# EAGLE design M-N-SRAM-V3 (EAGLE 9.4.2)
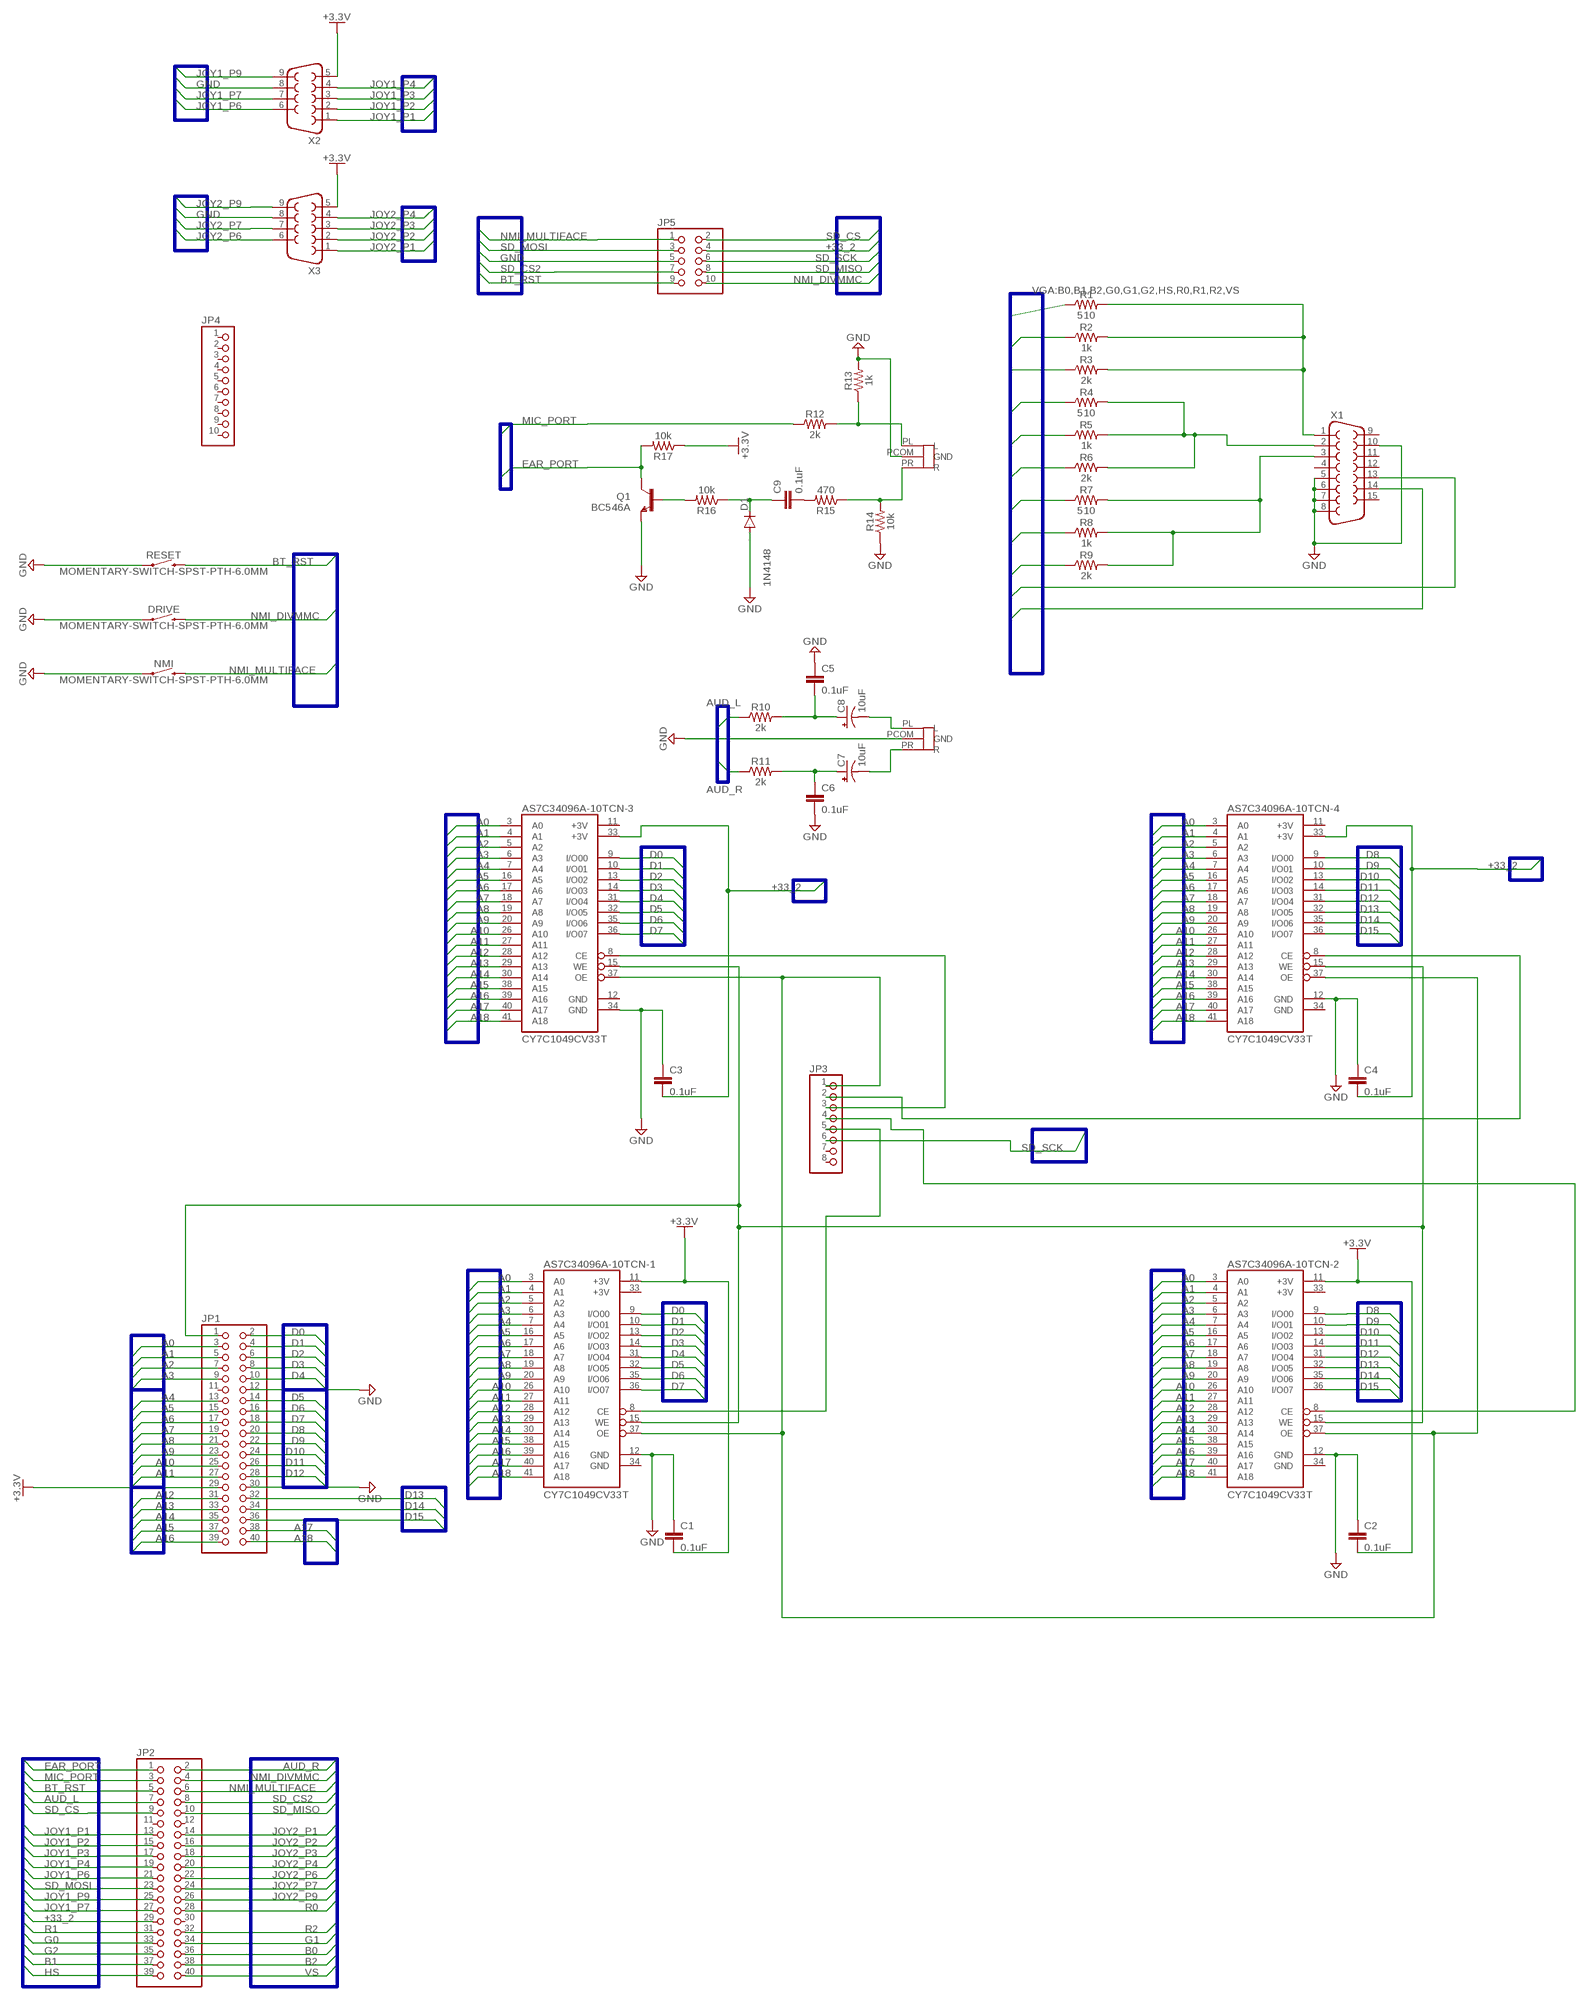
[diagram p0: schematic, sheet 1]

## Parts
AS7C34096A-10TCN-1  CY7C1049CV33T  [TSOPII-Z44]
AS7C34096A-10TCN-2  CY7C1049CV33T  [TSOPII-Z44]
AS7C34096A-10TCN-3  CY7C1049CV33T  [TSOPII-Z44]
AS7C34096A-10TCN-4  CY7C1049CV33T  [TSOPII-Z44]
AUDIOOUT  AUDIOJACK  [AUDIOJACK]
C1  0.1uF  0.1UF-KIT-EZ-50V-20%  [CAP-PTH-SMALL-KIT]
C2  0.1uF  0.1UF-KIT-EZ-50V-20%  [CAP-PTH-SMALL-KIT]
C3  0.1uF  0.1UF-KIT-EZ-50V-20%  [CAP-PTH-SMALL-KIT]
C4  0.1uF  0.1UF-KIT-EZ-50V-20%  [CAP-PTH-SMALL-KIT]
C5  0.1uF  0.1UF-KIT-EZ-50V-20%  [CAP-PTH-SMALL-KIT]
C6  0.1uF  0.1UF-KIT-EZ-50V-20%  [CAP-PTH-SMALL-KIT]
C7  10uF  10UF-POLAR-RADIAL-2.5MM-25V-20%  [CPOL-RADIAL-2.5MM-5MM]
C8  10uF  10UF-POLAR-RADIAL-2.5MM-25V-20%  [CPOL-RADIAL-2.5MM-5MM]
C9  0.1uF  0.1UF-KIT-EZ-50V-20%  [CAP-PTH-SMALL-KIT]
D1  1N4148  1N4148DO35-7  [DO35-7]
DRIVE  MOMENTARY-SWITCH-SPST-PTH-6.0MM  [TACTILE_SWITCH_PTH_6.0MM]
EAR/MIC  AUDIOJACK  [AUDIOJACK]
JP1  PINHD-2X20  [2X20]
JP2  PINHD-2X20  [2X20]
JP3  PINHD-1X8  [1X08]
JP4  PINHD-1X10  [1X10]
JP5  PINHD-2X5  [2X05]
NMI  MOMENTARY-SWITCH-SPST-PTH-6.0MM  [TACTILE_SWITCH_PTH_6.0MM]
Q1  BC546A  [TO92-EBC]
R1  510  1KOHM-HORIZ-1/4W-1%  [AXIAL-0.3]
R2  1k  1KOHM-HORIZ-1/4W-1%  [AXIAL-0.3]
R3  2k  1KOHM-HORIZ-1/4W-1%  [AXIAL-0.3]
R4  510  1KOHM-HORIZ-1/4W-1%  [AXIAL-0.3]
R5  1k  1KOHM-HORIZ-1/4W-1%  [AXIAL-0.3]
R6  2k  1KOHM-HORIZ-1/4W-1%  [AXIAL-0.3]
R7  510  1KOHM-HORIZ-1/4W-1%  [AXIAL-0.3]
R8  1k  1KOHM-HORIZ-1/4W-1%  [AXIAL-0.3]
R9  2k  1KOHM-HORIZ-1/4W-1%  [AXIAL-0.3]
R10  2k  1KOHM-HORIZ-1/4W-1%  [AXIAL-0.3]
R11  2k  1KOHM-HORIZ-1/4W-1%  [AXIAL-0.3]
R12  2k  1KOHM-HORIZ-1/4W-1%  [AXIAL-0.3]
R13  1k  1KOHM-HORIZ-1/4W-1%  [AXIAL-0.3]
R14  10k  1KOHM-HORIZ-1/4W-1%  [AXIAL-0.3]
R15  470  1KOHM-HORIZ-1/4W-1%  [AXIAL-0.3]
R16  10k  1KOHM-HORIZ-1/4W-1%  [AXIAL-0.3]
R17  10k  1KOHM-HORIZ-1/4W-1%  [AXIAL-0.3]
RESET  MOMENTARY-SWITCH-SPST-PTH-6.0MM  [TACTILE_SWITCH_PTH_6.0MM]
X1  F15HDH  [HDF15H]
X2  F09H  [F09H]
X3  F09H  [F09H]

## Nets
+3.3V: AS7C34096A-10TCN-1.11(+3V) AS7C34096A-10TCN-2.11(+3V) C1.2 C2.2 R17.P$1 X2.5 X3.5
+3V: JP1.29 ; supply symbol labelled +3.3V
+33_2: AS7C34096A-10TCN-3.33(+3V) AS7C34096A-10TCN-4.33(+3V) C3.2 C4.2 JP2.29 JP5.4
A0: AS7C34096A-10TCN-1.3(A0) AS7C34096A-10TCN-2.3(A0) AS7C34096A-10TCN-3.3(A0) AS7C34096A-10TCN-4.3(A0) JP1.3
A1: AS7C34096A-10TCN-1.4(A1) AS7C34096A-10TCN-2.4(A1) AS7C34096A-10TCN-3.4(A1) AS7C34096A-10TCN-4.4(A1) JP1.5
A2: AS7C34096A-10TCN-1.5(A2) AS7C34096A-10TCN-2.5(A2) AS7C34096A-10TCN-3.5(A2) AS7C34096A-10TCN-4.5(A2) JP1.7
A3: AS7C34096A-10TCN-1.6(A3) AS7C34096A-10TCN-2.6(A3) AS7C34096A-10TCN-3.6(A3) AS7C34096A-10TCN-4.6(A3) JP1.9
A4: AS7C34096A-10TCN-1.7(A4) AS7C34096A-10TCN-2.7(A4) AS7C34096A-10TCN-3.7(A4) AS7C34096A-10TCN-4.7(A4) JP1.13
A5: AS7C34096A-10TCN-1.16(A5) AS7C34096A-10TCN-2.16(A5) AS7C34096A-10TCN-3.16(A5) AS7C34096A-10TCN-4.16(A5) JP1.15
A6: AS7C34096A-10TCN-1.17(A6) AS7C34096A-10TCN-2.17(A6) AS7C34096A-10TCN-3.17(A6) AS7C34096A-10TCN-4.17(A6) JP1.17
A7: AS7C34096A-10TCN-1.18(A7) AS7C34096A-10TCN-2.18(A7) AS7C34096A-10TCN-3.18(A7) AS7C34096A-10TCN-4.18(A7) JP1.19
A8: AS7C34096A-10TCN-1.19(A8) AS7C34096A-10TCN-2.19(A8) AS7C34096A-10TCN-3.19(A8) AS7C34096A-10TCN-4.19(A8) JP1.21
A9: AS7C34096A-10TCN-1.20(A9) AS7C34096A-10TCN-2.20(A9) AS7C34096A-10TCN-3.20(A9) AS7C34096A-10TCN-4.20(A9) JP1.23
A10: AS7C34096A-10TCN-1.26(A10) AS7C34096A-10TCN-2.26(A10) AS7C34096A-10TCN-3.26(A10) AS7C34096A-10TCN-4.26(A10) JP1.25
A11: AS7C34096A-10TCN-1.27(A11) AS7C34096A-10TCN-2.27(A11) AS7C34096A-10TCN-3.27(A11) AS7C34096A-10TCN-4.27(A11) JP1.27
A12: AS7C34096A-10TCN-1.28(A12) AS7C34096A-10TCN-2.28(A12) AS7C34096A-10TCN-3.28(A12) AS7C34096A-10TCN-4.28(A12) JP1.31
A13: AS7C34096A-10TCN-1.29(A13) AS7C34096A-10TCN-2.29(A13) AS7C34096A-10TCN-3.29(A13) AS7C34096A-10TCN-4.29(A13) JP1.33
A14: AS7C34096A-10TCN-1.30(A14) AS7C34096A-10TCN-2.30(A14) AS7C34096A-10TCN-3.30(A14) AS7C34096A-10TCN-4.30(A14) JP1.35
A15: AS7C34096A-10TCN-1.38(A15) AS7C34096A-10TCN-2.38(A15) AS7C34096A-10TCN-3.38(A15) AS7C34096A-10TCN-4.38(A15) JP1.37
A16: AS7C34096A-10TCN-1.39(A16) AS7C34096A-10TCN-2.39(A16) AS7C34096A-10TCN-3.39(A16) AS7C34096A-10TCN-4.39(A16) JP1.39
A17: AS7C34096A-10TCN-1.40(A17) AS7C34096A-10TCN-2.40(A17) AS7C34096A-10TCN-3.40(A17) AS7C34096A-10TCN-4.40(A17) JP1.38
A18: AS7C34096A-10TCN-1.41(A18) AS7C34096A-10TCN-2.41(A18) AS7C34096A-10TCN-3.41(A18) AS7C34096A-10TCN-4.41(A18) JP1.40
AUD_L: JP2.7 R10.P$1
AUD_R: JP2.2 R11.P$1
AUDIO_OUT_L: AUDIOOUT.PL(L) C8.2(-)
AUDIO_OUT_L1: C5.2 C8.1(+) R10.P$2
AUDIO_OUT_R: AUDIOOUT.PR(R) C7.2(-)
AUDIO_OUT_R1: C6.1 C7.1(+) R11.P$2
B0: JP2.36 R7.P$1
B1: JP2.37 R8.P$1
B2: JP2.38 R9.P$1
BT_RST: JP2.5 JP5.9 RESET.3
D0: AS7C34096A-10TCN-1.9(I/O00) AS7C34096A-10TCN-3.9(I/O00) JP1.2
D1: AS7C34096A-10TCN-1.10(I/O01) AS7C34096A-10TCN-3.10(I/O01) JP1.4
D2: AS7C34096A-10TCN-1.13(I/O02) AS7C34096A-10TCN-3.13(I/O02) JP1.6
D3: AS7C34096A-10TCN-1.14(I/O03) AS7C34096A-10TCN-3.14(I/O03) JP1.8
D4: AS7C34096A-10TCN-1.31(I/O04) AS7C34096A-10TCN-3.31(I/O04) JP1.10
D5: AS7C34096A-10TCN-1.32(I/O05) AS7C34096A-10TCN-3.32(I/O05) JP1.14
D6: AS7C34096A-10TCN-1.35(I/O06) AS7C34096A-10TCN-3.35(I/O06) JP1.16
D7: AS7C34096A-10TCN-1.36(I/O07) AS7C34096A-10TCN-3.36(I/O07) JP1.18
D8: AS7C34096A-10TCN-2.9(I/O00) AS7C34096A-10TCN-4.9(I/O00) JP1.20
D9: AS7C34096A-10TCN-2.10(I/O01) AS7C34096A-10TCN-4.10(I/O01) JP1.22
D10: AS7C34096A-10TCN-2.13(I/O02) AS7C34096A-10TCN-4.13(I/O02) JP1.24
D11: AS7C34096A-10TCN-2.14(I/O03) AS7C34096A-10TCN-4.14(I/O03) JP1.26
D12: AS7C34096A-10TCN-2.31(I/O04) AS7C34096A-10TCN-4.31(I/O04) JP1.28
D13: AS7C34096A-10TCN-2.32(I/O05) AS7C34096A-10TCN-4.32(I/O05) JP1.32
D14: AS7C34096A-10TCN-2.35(I/O06) AS7C34096A-10TCN-4.35(I/O06) JP1.34
D15: AS7C34096A-10TCN-2.36(I/O07) AS7C34096A-10TCN-4.36(I/O07) JP1.36
EAR_PORT: JP2.1 Q1.C R17.P$2
G0: JP2.33 R4.P$1
G1: JP2.34 R5.P$1
G2: JP2.35 R6.P$1
GND: AS7C34096A-10TCN-1.12(GND) AS7C34096A-10TCN-2.12(GND) AS7C34096A-10TCN-3.34(GND) AS7C34096A-10TCN-4.12(GND) AUDIOOUT.PCOM(GND) C1.1 C2.1 C3.1 C4.1 C5.1 C6.2 D1.A DRIVE.1 EAR/MIC.PCOM(GND) JP1.12 JP1.30 JP5.5 NMI.1 Q1.E R13.P$2 R14.P$1 RESET.1 X1.5 X1.6 X1.7 X1.8 X1.10 X2.8 X3.8
HS: JP2.39 X1.13
JOY1_P1: JP2.13 X2.1
JOY1_P2: JP2.15 X2.2
JOY1_P3: JP2.17 X2.3
JOY1_P4: JP2.19 X2.4
JOY1_P6: JP2.21 X2.6
JOY1_P7: JP2.27 X2.7
JOY1_P9: JP2.25 X2.9
JOY2_P1: JP2.14 X3.1
JOY2_P2: JP2.16 X3.2
JOY2_P3: JP2.18 X3.3
JOY2_P4: JP2.20 X3.4
JOY2_P6: JP2.22 X3.6
JOY2_P7: JP2.24 X3.7
JOY2_P9: JP2.26 X3.9
MIC_PORT: JP2.3 R12.P$1
N$5: EAR/MIC.PL(L) R12.P$2 R13.P$1
N$7: C9.2 R15.P$2
N$8: EAR/MIC.PR(R) R14.P$2 R15.P$1
N$9: C9.1 D1.C R16.P$1
N$10: Q1.B R16.P$2
NMI_DIVMMC: DRIVE.3 JP2.4 JP5.10
NMI_MULTIFACE: JP2.6 JP5.1 NMI.3
R0: JP2.28 R1.P$1
R1: JP2.31 R2.P$1
R2: JP2.32 R3.P$1
RAM_CE1: AS7C34096A-10TCN-1.8(CE) JP3.5
RAM_CE2: AS7C34096A-10TCN-2.8(CE) JP3.4
RAM_CE3: AS7C34096A-10TCN-3.8(CE) JP3.3
RAM_CE4: AS7C34096A-10TCN-4.8(CE) JP3.2
RAM_OE: AS7C34096A-10TCN-1.37(OE) AS7C34096A-10TCN-2.37(OE) AS7C34096A-10TCN-3.37(OE) AS7C34096A-10TCN-4.37(OE) JP3.1
RAM_WE: AS7C34096A-10TCN-1.15(WE) AS7C34096A-10TCN-2.15(WE) AS7C34096A-10TCN-3.15(WE) AS7C34096A-10TCN-4.15(WE) JP1.1
SD_CS: JP2.9 JP5.2
SD_CS2: JP2.8 JP5.7
SD_MISO: JP2.10 JP5.8
SD_MOSI: JP2.23 JP5.3
SD_SCK: JP3.6 JP5.6
VGA_BLUE: R7.P$2 R8.P$2 R9.P$2 X1.3
VGA_GREEN: R4.P$2 R5.P$2 R6.P$2 X1.2
VGA_RED: R1.P$2 R2.P$2 R3.P$2 X1.1
VS: JP2.40 X1.14
Unconnected: JP1.11 JP2.11 JP2.12 JP2.30 JP3.7 JP3.8 JP4.1 JP4.2 JP4.3 JP4.4 JP4.5 JP4.6 JP4.7 JP4.8 JP4.9 JP4.10 X1.4 X1.9 X1.11 X1.12 X1.15

## Buses
ADDRESS:A0,A1,A2,A3,A4,A5,A6,A7,A8,A9,A10,A11,A12,A13,A14,A15,A16,A17,A18
DATA:D0,D1,D2,D3,D4,D5,D6,D7,D8,D9,D10,D11,D12,D13,D14,D15
VGA:B0,B1,B2,G0,G1,G2,HS,R0,R1,R2,VS
AUDIO:AUD_L,AUD_R
EARMIC:EAR_PORT,MIC_PORT
JP2_ODD:+33_2,AUD_L,B1,BT_RST,EAR_PORT,G0,G2,HS,JOY1_P1,JOY1_P2,JOY1_P3,JOY1_P4,JOY1_P6,JOY1_P7,JOY1_P9,MIC_PORT,R1,SD_CS,SD_MOSI
JP2_EVEN:AUD_R,B0,B2,G1,GND,JOY2_P1,JOY2_P2,JOY2_P3,JOY2_P4,JOY2_P6,JOY2_P7,JOY2_P9,NMI_DIVMMC,NMI_MULTIFACE,R0,R2,SD_CS2,SD_MISO,VS
BUTTONS:BT_RST,NMI_DIVMMC,NMI_MULTIFACE
JOY1_2:JOY1_P1,JOY1_P2,JOY1_P3,JOY1_P4
JOY1_1:GND,JOY1_P6,JOY1_P7,JOY1_P9
JOY2_1:GND,JOY2_P6,JOY2_P7,JOY2_P9
JOY2_2:JOY2_P1,JOY2_P2,JOY2_P3,JOY2_P4
SRAM_3_VCC:+33_2
SRAM4_VCC:+33_2
JP13_1:BT_RST,GND,NMI_MULTIFACE,SD_CS2,SD_MOSI
JP13_2:+33_2,NMI_DIVMMC,SD_CS,SD_MISO,SD_SCK
JP3:SD_SCK

## Power pins joined to a net without a drawn wire
+3V: AS7C34096A-10TCN-1.33(+3V) AS7C34096A-10TCN-2.33(+3V) AS7C34096A-10TCN-3.11(+3V) AS7C34096A-10TCN-4.11(+3V)
GND: AS7C34096A-10TCN-1.34(GND) AS7C34096A-10TCN-2.34(GND) AS7C34096A-10TCN-3.12(GND) AS7C34096A-10TCN-4.34(GND)

## Library data of the parts
AS7C34096A-10TCN-1-AS7C34096A-10TCN-4 = memory-sram:CY7C1049CV33: 4-Mbit (512K x 8) Static RAM Source: CYPRESS cy7c1049cv33_8.pdf
AUDIOOUT EAR/MIC = my-library:AUDIOJACK
C1-C6 C9 = SparkFun-Capacitors:0.1UF: 0.1µF ceramic capacitors A capacitor is a passive two-terminal electrical component used to store electrical energy temporarily in an electric field.; PROD_ID: CAP-08370
C7 C8 = SparkFun-Capacitors:10UF-POLAR: 10.0µF polarized capacitors A capacitor is a passive two-terminal electrical component used to store electrical energy temporarily in an electric field.; PROD_ID: CAP-08440
D1 = diode:1N4148: DIODE high speed (Philips)
DRIVE NMI RESET = SparkFun-Switches:MOMENTARY-SWITCH-SPST: Momentary Switch (Pushbutton) - SPST Normally-open (NO) SPST momentary switches (buttons, pushbuttons). Variants PTH-12MM - 12mm square, through-hole Momentary Pushbutton Switch - 12mm Square <https://www.sparkfun.com/products/9190> (COM-09190) PTH-6.0MM, PTH-6.0MM-KIT - 6.0mm square, through-hole Mini Pushbutton Switch <https://www.sparkfun.com/products/97> (COM-00097) KIT package intended for soldering kit's - only one side of pads' copper is exposed. PTH-RIGHT-ANGLE-KIT - Right-angle, through-hole Right Angle Tactile Button <https://www.sparkfun.com/products/10791> - Used on SparkFun BigTime Watch Kit <https://www.sparkfun.com/products/11734> SMD-12MM - 12mm square, surface-mount Tactile Button - SMD (12mm) <https://www.sparkfun.com/products/12993> (COM-12993) Used on SparkFun PicoBoard <https://www.sparkfun.com/products/11888> SMD-4.5MM - 4.5mm Square Trackball Switch Used on SparkFun Blackberry Trackballer Breakout <https://www.sparkfun.com/products/13169> SMD-4.6MMX2.8MM - 4.60mm x 2.80mm, surface mount Used on SparkFun SAMD21 Mini Breakout <https://www.sparkfun.com/products/13664> SMD-5.2MM, SMD-5.2-REDUNDANT - 5.2mm square, surface-mount Mini Pushbutton Switch - SMD <https://www.sparkfun.com/products/8720> (COM-08720) Used on Arduino Pro Mini <https://www.sparkfun.com/products/11114> REDUNDANT package connects both switch circuits together SMD-6.0X3.5MM - 6.0 x 3.5mm, surface mount Momentary Reset Switch SMD <https://www.sparkfun.com/products/8229> (COM-08229) SMD-6.2MM-TALL - 6.2mm square, surface mount Tactile Button - SMD (6mm) <https://www.sparkfun.com/products/12992> Used on SparkFun Digital Sandbox <https://www.sparkfun.com/products/12651> SMD-RIGHT-ANGLE - Right-angle, surface mount Used on SparkFun Block for Intel® Edison - Arduino <https://www.sparkfun.com/products/13036>; PROD_ID: SWCH-08441; SF_SKU: COM-00097
JP1 JP2 = pinhead:PINHD-2X20: PIN HEADER
JP3 = pinhead:PINHD-1X8: PIN HEADER
JP4 = pinhead:PINHD-1X10: PIN HEADER
JP5 = pinhead:PINHD-2X5: PIN HEADER
Q1 = transistor-npn:BC546*: NPN Transistor
R1 R3 R4 R6 R7 R9-R12 R14-R17 = SparkFun-Resistors:1KOHM: 1kΩ resistor A resistor is a passive two-terminal electrical component that implements electrical resistance as a circuit element. Resistors act to reduce current flow, and, at the same time, act to lower voltage levels within circuits. - Wikipedia; PROD_ID: RES-12182; VALUE: 1k
R2 R5 R8 R13 = SparkFun-Resistors:1KOHM: 1kΩ resistor A resistor is a passive two-terminal electrical component that implements electrical resistance as a circuit element. Resistors act to reduce current flow, and, at the same time, act to lower voltage levels within circuits. - Wikipedia; PROD_ID: RES-12182
X1 = con-subd:F15: SUB-D; OC_FARNELL: unknown; OC_NEWARK: unknown
X2 X3 = con-subd:F09: SUB-D; OC_FARNELL: unknown; OC_NEWARK: unknown

## Board
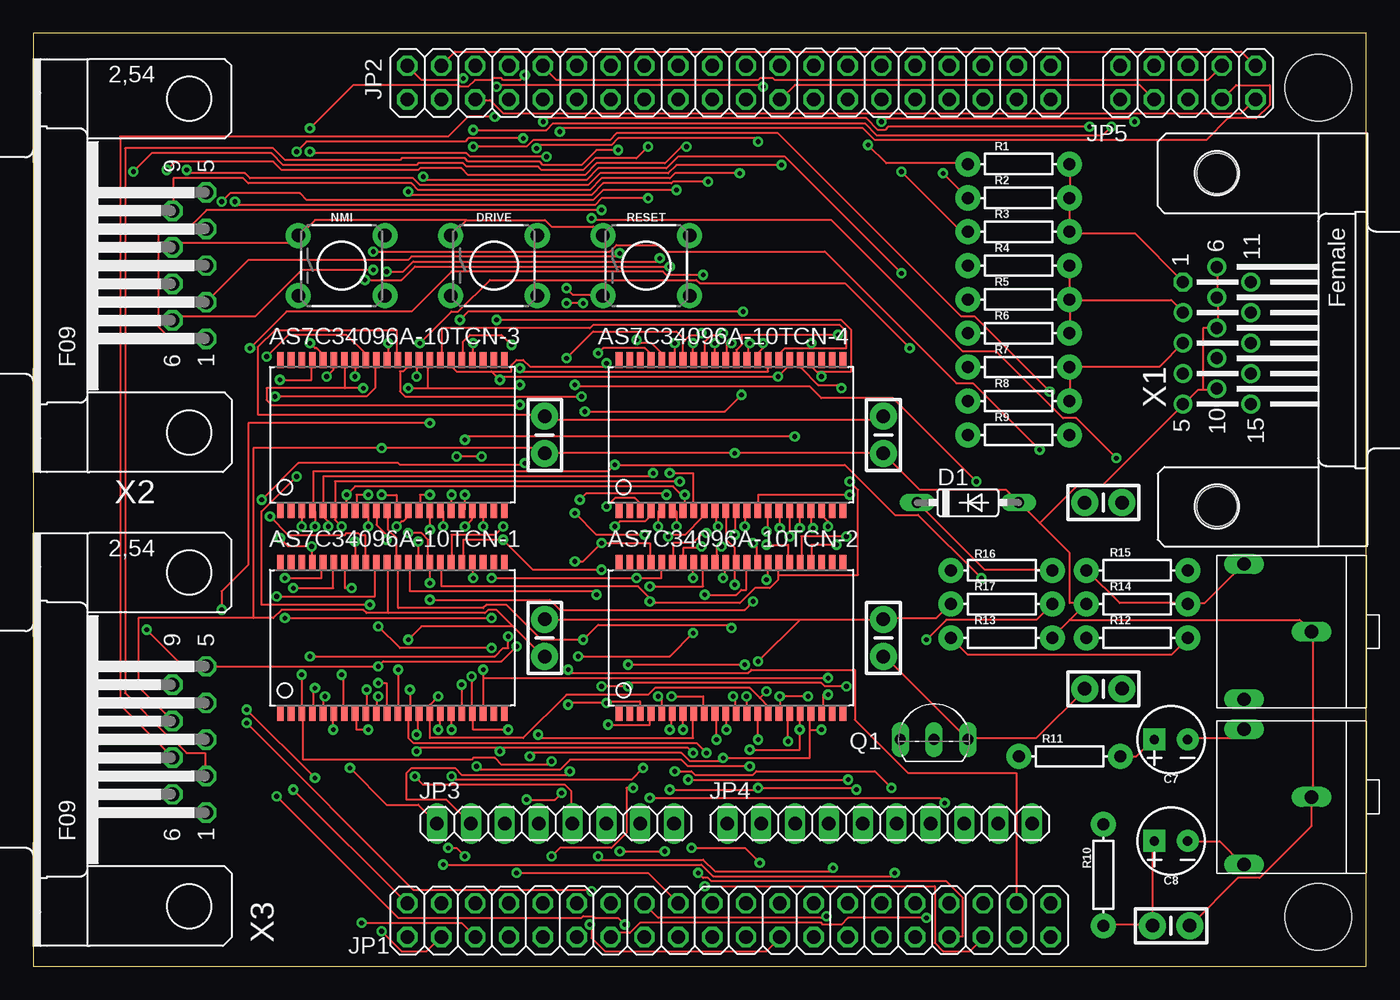
[diagram p1: board, top side]
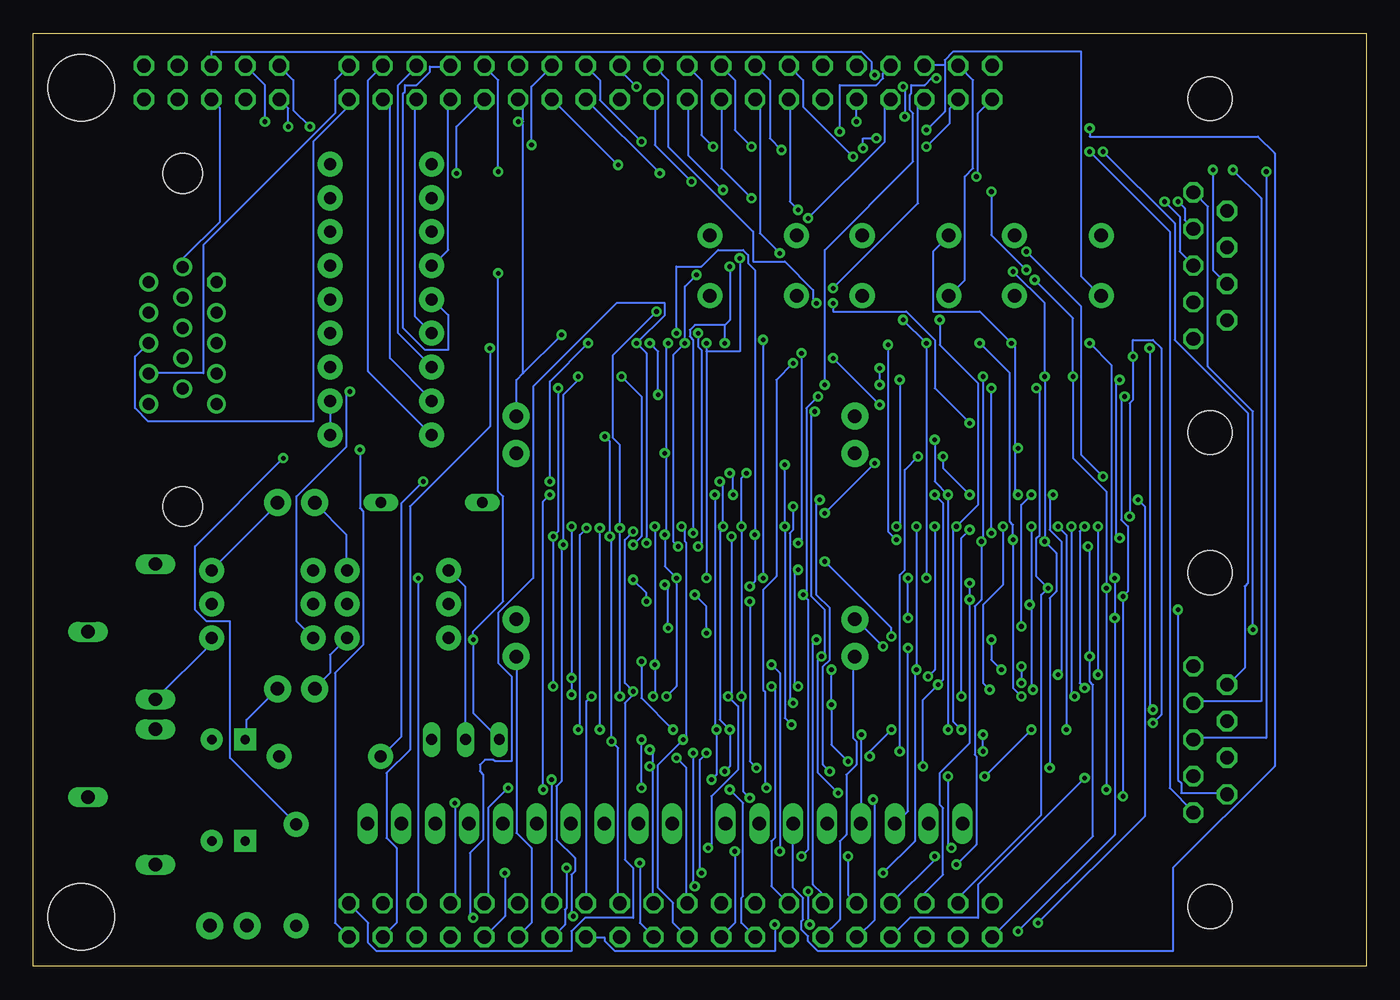
[diagram p2: board, bottom side, seen from below]

Size 100 x 70 mm. Coordinates in mm from the lower left corner, seen from the top.
Outline: 0,0 100,0 100,70 0,70 0,0
Copper layers (1*16): Top 0.035mm / dielectric 1.5mm / Bottom 0.035mm
Design rules "default": minimum track width 6mil, minimum drill 0.35mm, track to track 6mil, track to pad 6mil, pad to pad 6mil, via to via 6mil, smd to smd 6mil, copper to edge 40mil, drill to drill 6mil, minimum pad ring 10mil, minimum via ring 8mil, stop-mask expansion 4mil, vias tented up to drill 0mil, thermal gap 10mil
Holes 5 mm at 96.4,3.7 96.4,65.93

### Footprints (pad centres in the part's own frame; a part is rotated, then mirrored left to right if it is on the bottom)
TSOPII-Z44 = smd 0.5 x 1.2: 1 -8.4,-5.627; 2 -7.6,-5.627; 3 -6.8,-5.627; 4 -6,-5.627; 5 -5.2,-5.627; 6 -4.4,-5.627; 7 -3.6,-5.627; 8 -2.8,-5.627; 9 -2,-5.627; 10 -1.2,-5.627; 11 -0.4,-5.627; 12 0.4,-5.627; 13 1.2,-5.627; 14 2,-5.627; 15 2.8,-5.627; 16 3.6,-5.627; 17 4.4,-5.627; 18 5.2,-5.627; 19 6,-5.627; 20 6.8,-5.627; 21 7.6,-5.627; 22 8.4,-5.627; 23 8.4,5.627; 24 7.6,5.627; 25 6.8,5.627; 26 6,5.627; 27 5.2,5.627; 28 4.4,5.627; 29 3.6,5.627; 30 2.8,5.627; 31 2,5.627; 32 1.2,5.627; 33 0.4,5.627; 34 -0.4,5.627; 35 -1.2,5.627; 36 -2,5.627; 37 -2.8,5.627; 38 -3.6,5.627; 39 -4.4,5.627; 40 -5.2,5.627; 41 -6,5.627; 42 -6.8,5.627; 43 -7.6,5.627; 44 -8.4,5.627
AUDIOJACK = drill 1 long: PCOM 0,-3.81; PL -5.08,1.27; PR 5.08,1.27
CAP-PTH-SMALL-KIT = drill 1.016 pad 2.032: 1 -1.397,0; 2 1.397,0
CPOL-RADIAL-2.5MM-5MM = drill 0.7 pad 1.651 square: 1 1.25,0 | drill 0.7 pad 1.651: 2 -1.25,0
DO35-7 = drill 0.813 long: A 3.81,0; C -3.81,0
TACTILE_SWITCH_PTH_6.0MM = drill 1.016 pad 1.88: 1 -3.251,2.261; 2 3.251,2.261; 3 -3.251,-2.261; 4 3.251,-2.261
2X20 = drill 1.016 octagon: 1 -24.13,-1.27; 2 -24.13,1.27; 3 -21.59,-1.27; 4 -21.59,1.27; 5 -19.05,-1.27; 6 -19.05,1.27; 7 -16.51,-1.27; 8 -16.51,1.27; 9 -13.97,-1.27; 10 -13.97,1.27; 11 -11.43,-1.27; 12 -11.43,1.27; 13 -8.89,-1.27; 14 -8.89,1.27; 15 -6.35,-1.27; 16 -6.35,1.27; 17 -3.81,-1.27; 18 -3.81,1.27; 19 -1.27,-1.27; 20 -1.27,1.27; 21 1.27,-1.27; 22 1.27,1.27; 23 3.81,-1.27; 24 3.81,1.27; 25 6.35,-1.27; 26 6.35,1.27; 27 8.89,-1.27; 28 8.89,1.27; 29 11.43,-1.27; 30 11.43,1.27; 31 13.97,-1.27; 32 13.97,1.27; 33 16.51,-1.27; 34 16.51,1.27; 35 19.05,-1.27; 36 19.05,1.27; 37 21.59,-1.27; 38 21.59,1.27; 39 24.13,-1.27; 40 24.13,1.27
1X08 = drill 1.016 long: 1 -8.89,0; 2 -6.35,0; 3 -3.81,0; 4 -1.27,0; 5 1.27,0; 6 3.81,0; 7 6.35,0; 8 8.89,0
1X10 = drill 1.016 long: 1 -11.43,0; 2 -8.89,0; 3 -6.35,0; 4 -3.81,0; 5 -1.27,0; 6 1.27,0; 7 3.81,0; 8 6.35,0; 9 8.89,0; 10 11.43,0
2X05 = drill 1.016 octagon: 1 -5.08,-1.27; 2 -5.08,1.27; 3 -2.54,-1.27; 4 -2.54,1.27; 5 0,-1.27; 6 0,1.27; 7 2.54,-1.27; 8 2.54,1.27; 9 5.08,-1.27; 10 5.08,1.27
TO92-EBC = drill 0.813 long: B 0,-1.27; C -2.54,-1.27; E 2.54,-1.27
AXIAL-0.3 = drill 0.9 pad 1.88: P$1 -3.81,0; P$2 3.81,0
HDF15H = drill 0.9 octagon: 1 4.329,2.54 | drill 0.9: 2 2.043,2.54; 3 -0.243,2.54; 4 -2.529,2.54; 5 -4.815,2.54; 6 5.472,0; 7 3.186,0; 8 0.9,0; 9 -1.386,0; 10 -3.672,0; 11 4.329,-2.54; 12 2.043,-2.54; 13 -0.243,-2.54; 14 -2.529,-2.54; 15 -4.815,-2.54 | hole 3: -12.5,0; 12.5,0
F09H = drill 1.016 octagon: 1 -5.486,-1.27; 2 -2.743,-1.27; 3 0,-1.27; 4 2.743,-1.27; 5 5.486,-1.27; 6 -4.115,1.27; 7 -1.372,1.27; 8 1.372,1.27; 9 4.115,1.27 | hole 3.302: -12.522,0; 12.522,0

### Placement (x,y rotation side)
AS7C34096A-10TCN-1  26.94,24.63 0 top
AS7C34096A-10TCN-2  52.34,24.63 0 top
AS7C34096A-10TCN-3  26.94,39.87 0 top
AS7C34096A-10TCN-4  52.34,39.87 0 top
AUDIOOUT  92.1,12.7 90 top
C1  38.37,24.63 90 top
C2  63.77,24.63 90 top
C3  38.37,39.87 90 top
C4  63.77,39.87 90 top
C5  85.36,3.04 180 top
C6  80.28,20.82 180 top
C7  85.36,17.01 180 top
C8  85.36,9.39 180 top
C9  80.28,34.79 0 top
D1  70.12,34.79 0 top
DRIVE  34.56,52.57 0 top
EAR/MIC  92.1,25.1 90 top
JP1  52.2,3.45 180 top
JP2  52.2,66.3 0 top
JP3  39.18,10.7 0 top
JP4  63.5,10.7 0 top
JP5  86.63,66.3 0 top
NMI  23.13,52.57 0 top
Q1  67.58,18.28 0 top
R1  73.93,60.19 0 top
R2  73.93,57.65 0 top
R3  73.93,55.11 0 top
R4  73.93,52.57 0 top
R5  73.93,50.03 0 top
R6  73.93,47.49 0 top
R7  73.93,44.95 0 top
R8  73.93,42.41 0 top
R9  73.93,39.87 0 top
R10  80.28,6.85 270 top
R11  77.74,15.74 0 top
R12  82.82,24.63 0 top
R13  72.66,24.63 0 top
R14  82.82,27.17 0 top
R15  82.82,29.71 0 top
R16  72.66,29.71 180 top
R17  72.66,27.17 0 top
RESET  45.99,52.57 0 top
X1  88.8,47 90 top
X2  11.7,52.57 90 top
X3  11.7,17.01 90 top

### Tracks (layer width: path | path; a pad name or v marks a point on that pad's centre or on a via)
+3.3V  (via drill 0.35)
  Top 0.152: v52,17.75 52,19 AS7C34096A-10TCN-2.11 | 57.5,26 v54.38,22.88 | 57.5,26 63.75,26 C2.2 63.88,26.12 67.75,26.12 68.75,27.12 R17.P$1 | 57.5,26 38.38,26 C1.2 | v25.88,21.25 26.5,21.25 26.5,19.12 AS7C34096A-10TCN-1.11 | v8.5,25.25 11.25,22.5 12.88,22.5 X3.5 13,22.5 v25.88,22.5 26.25,22.88 35.12,22.88 v36.25,24
  Bottom 0.152: v52,17.75 54.38,20.12 v54.38,22.88 | v25.88,22.5 v25.88,21.25 | v8.5,25.25 8.5,41.62 11.88,45 11.88,57 12.88,58 X2.5 | v36.25,24 38.25,26 C1.2
+3V  (via drill 0.35)
  Top 0.152: AS7C34096A-10TCN-4.11 52,34.12 52,32 52.62,31.38 52.62,30.38 AS7C34096A-10TCN-2.33 52.62,30.25 v52.62,28.62 | AS7C34096A-10TCN-3.11 26.62,34.12 26.62,32.75 27.25,32.12 27.25,30.38 AS7C34096A-10TCN-1.33 27.38,30.25 27.38,26.88 33.75,26.88 34,27.12 35.5,27.12 38.12,24.5 v41.25,24.5 42.38,25.62 52.12,25.62 v52.38,25.38
  Bottom 0.152: v41.25,24.5 41.5,24.25 41.5,6.12 40.88,5.5 40.88,4.75 JP1.29 | v52.62,28.62 52.38,28.38 v52.38,25.38
+33_2  (via drill 0.35)
  Top 0.152: AS7C34096A-10TCN-3.33 27.25,45.5 27.25,47.75 18.12,47.75 16.88,46.5 16.88,41.38 38.25,41.38 C3.2 38.38,41.25 38.62,41 63.5,41 63.75,41.25 C4.2 | v60.38,47.38 53.12,47.38 53.12,46.62 52.75,46.25 AS7C34096A-10TCN-4.33 | v82.62,63.38 82.38,63.62 63.88,63.62 v63.62,63.38
  Bottom 0.152: 63.25,44.5 63.75,44 63.75,41.38 C4.2 | 63.25,44.5 v60.38,47.38 | 63.25,44.5 63.25,63.38 | 63.25,63.38 63.25,64.62 63.62,65 JP2.29 | v82.62,63.38 82.62,66.12 84,67.5 JP5.4 | 63.25,63.38 v63.62,63.38
A0  (via drill 0.35)
  Top 0.152: v20.12,21.88 20.12,19.12 AS7C34096A-10TCN-1.3 20.25,19 20.25,15.5 32.88,15.5 33,15.62 34.62,15.62 35.12,15.12 38.62,15.12 v38.88,15.38 | v20.12,33 20.12,34.12 AS7C34096A-10TCN-3.3 | v43,34.5 43.62,35.12 45.12,35.12 45.5,34.75 45.5,34.25 AS7C34096A-10TCN-4.3 | AS7C34096A-10TCN-2.3 45.5,19.12 45.5,19.88 43.12,19.88 v43,19.75 40.25,19.75 v40.12,19.62 | v40.12,22.25 40.38,22 53.62,22 53.88,22.25 61.62,22.25 61.62,18.5 65.62,14.5 73.75,14.5 73.75,4.75 JP1.3
  Bottom 0.152: v20.12,33 v20.12,21.88 | v43,19.75 43.25,20 43.25,32.5 43,32.75 v43,34.5 | v40.12,22.25 v40.12,19.62 40.12,16.62 v38.88,15.38
A1  (via drill 0.35)
  Top 0.152: v21.12,20.88 21,20.88 21,19.12 AS7C34096A-10TCN-1.4 | v21.12,33 21.12,34.12 21,34.12 AS7C34096A-10TCN-3.4 21,34.25 21,37.12 43.12,37.12 v43.62,37.62 60.88,37.62 64.62,33.88 66.38,33.88 v71.12,29.12 | v43.12,18.12 46.25,18.12 46.25,19 AS7C34096A-10TCN-2.4 | v43.62,33 44,33.38 45.88,33.38 46.25,33.75 46.25,34.12 AS7C34096A-10TCN-4.4
  Bottom 0.152: v21.12,20.88 21.5,21.25 21.5,32.62 v21.12,33 | v43.12,18.12 43.62,18.62 v43.62,33 v43.62,37.62 | v71.12,29.12 71.12,4.88 71.25,4.75 JP1.5
A2  (via drill 0.35)
  Top 0.152: v21.88,20.25 21.75,20.25 21.75,19.12 AS7C34096A-10TCN-1.5 | v22.12,33 22.12,33.38 21.75,33.75 21.75,34.12 AS7C34096A-10TCN-3.5 21.75,36.75 46.25,36.75 v46.5,37 | v46.88,20.25 47.12,20.25 47.12,19.12 AS7C34096A-10TCN-2.5 | v46.88,33 46.88,34.12 47.12,34.12 AS7C34096A-10TCN-4.5 | v68.38,12.25 68,12.62 v46.25,12.62
  Bottom 0.152: v21.88,20.25 22.12,20.5 v22.12,33 | v68.38,12.25 68.38,5 68.62,4.75 JP1.7 | v46.25,12.62 46.75,13.12 46.75,20.12 v46.88,20.25 v46.88,33 46.88,36.62 v46.5,37
A3  (via drill 0.35)
  Top 0.152: v22.5,17.75 22.5,19 AS7C34096A-10TCN-1.6 | v23.12,33 22.62,33.5 22.62,34.12 AS7C34096A-10TCN-3.6 22.62,34.25 22.62,36.38 v48.5,36.38 | v47.75,17.75 47.88,17.75 47.88,19 AS7C34096A-10TCN-2.6 | v48.25,33 48.25,34.12 48,34.12 AS7C34096A-10TCN-4.6 | v64.38,13.38 63.12,14.62 54.25,14.62 54,14.38 49.62,14.38 49.38,14.62 v48.12,14.62
  Bottom 0.152: v22.5,17.75 22.5,32.38 v23.12,33 | v64.38,13.38 65.88,11.88 65.88,5 66.12,4.75 JP1.9 | v48.12,14.62 47.75,15 v47.75,17.75 48.5,18.5 48.5,32.75 v48.25,33 48.25,36.12 v48.5,36.38
A4  (via drill 0.35)
  Top 0.152: v23.12,21.88 23.25,21.88 23.25,19.12 AS7C34096A-10TCN-1.7 | AS7C34096A-10TCN-3.7 23.38,34.25 23.5,34.25 v23.5,35.38 24.12,36 48,36 48.62,35.38 v48.88,35.38 48.88,34.25 AS7C34096A-10TCN-4.7 | v48.75,17.75 AS7C34096A-10TCN-2.7 | v49.12,14 v61.12,14
  Bottom 0.152: v23.12,21.88 22.88,22.12 22.88,31.88 23.75,32.75 23.75,35.12 v23.5,35.38 | v48.88,35.38 48.88,17.88 v48.75,17.75 48.75,14.38 v49.12,14 | v61.12,14 61.12,4.75 JP1.13
A5  (via drill 0.35)
  Top 0.152: v30.38,17.75 30.5,17.75 30.5,19 AS7C34096A-10TCN-1.16 | v30.75,33 30.75,34.12 30.62,34.12 AS7C34096A-10TCN-3.16 | v58.12,20.25 v56,20.25 56,19.12 AS7C34096A-10TCN-2.16 | v56,32.88 56,34.12 AS7C34096A-10TCN-4.16 | v32,48.5 32.62,49.12 v53.25,49.12
  Bottom 0.152: v30.38,17.75 31,18.38 31,32.75 v30.75,33 29.12,34.62 29.12,43.75 32,46.62 v32,48.5 | v58.12,20.25 58.5,19.88 58.5,4.75 JP1.15 | v56,20.25 v56,32.88 56,39.12 56.5,39.62 56.5,45.88 v53.25,49.12
A6  (via drill 0.35)
  Top 0.152: v31.38,17.75 31.38,19 AS7C34096A-10TCN-1.17 | v31.38,35.38 31.38,34.25 AS7C34096A-10TCN-3.17 | v56.62,16.88 56.62,19 AS7C34096A-10TCN-2.17 | v56.75,32.25 56.75,34.12 AS7C34096A-10TCN-4.17 | v32.38,39.5 32.62,39.75 v57.12,39.75
  Bottom 0.152: v31.38,17.75 v31.38,35.38 32.38,36.38 v32.38,39.5 | JP1.17 56.12,4.75 56.12,16.38 v56.62,16.88 56.62,32.12 v56.75,32.25 56.75,39.38 v57.12,39.75
A7  (via drill 0.35)
  Top 0.152: v32.12,21.12 32.12,19.12 AS7C34096A-10TCN-1.18 | v32.38,35.38 32.38,34.25 32.25,34.25 AS7C34096A-10TCN-3.18 | v53.75,16.25 57.5,16.25 v57.5,17.75 57.5,19 AS7C34096A-10TCN-2.18 | v57.5,32.88 57.5,34.12 AS7C34096A-10TCN-4.18 | v33.25,15 33.5,14.75 39.5,14.75 40.25,15.5 48.62,15.5 49.12,15 v53.75,15
  Bottom 0.152: v32.38,35.38 31.75,34.75 31.75,21.5 v32.12,21.12 33.25,20 v33.25,15 | v53.75,16.25 53.5,16 53.5,15 | 53.5,15 53.5,4.75 JP1.19 | v57.5,17.75 v57.5,32.88 | 53.5,15 v53.75,15
A8  (via drill 0.35)
  Top 0.152: v32.88,21.75 32.88,19.12 AS7C34096A-10TCN-1.19 33,19 33,17.75 v35.62,17.75 | v32.38,33 32.88,33.5 32.88,34.12 AS7C34096A-10TCN-3.19 | 58.25,17.75 58.25,15.62 v51.75,15.62 51.5,15.38 49.25,15.38 48.62,16 37.5,16 v37.25,15.75 | 58.25,17.75 58.25,19 AS7C34096A-10TCN-2.19 | v58.5,32.88 58.38,32.88 58.38,34.12 AS7C34096A-10TCN-4.19 | 58.25,17.75 v59.12,17.75
  Bottom 0.152: v32.88,21.75 32.38,22.25 v32.38,33 | v51.75,15.62 51,14.88 51,4.75 JP1.21 | v58.5,32.88 59,32.38 59,17.88 v59.12,17.75 | v35.62,17.75 37.25,16.12 v37.25,15.75
A9  (via drill 0.35)
  Top 0.152: v59.62,20.38 59.25,20.38 59.25,19.12 AS7C34096A-10TCN-2.20 | v59.62,33 59.62,33.38 59.25,33.75 59.25,34.12 AS7C34096A-10TCN-4.20 | v33.75,22.25 33.75,21.62 | 33.75,21.62 33.75,19.12 AS7C34096A-10TCN-1.20 | v33.75,33 33.75,34.12 AS7C34096A-10TCN-3.20 | v36.25,7 46.12,7 48.38,4.75 JP1.23 | 33.75,21.62 v59.62,21.62
  Bottom 0.152: v59.62,33 v59.62,21.62 v59.62,20.38 | v33.75,33 v33.75,22.25 33.88,22.12 33.88,9.38 v36.25,7
A10  (via drill 0.35)
  Top 0.152: v33,29.12 33,30.25 AS7C34096A-10TCN-1.26 | v33,46.75 33,45.5 AS7C34096A-10TCN-3.26 | v60.25,31.62 58.38,31.62 58.38,30.38 AS7C34096A-10TCN-2.26 | 58.75,44.62 58.38,45 58.38,45.38 AS7C34096A-10TCN-4.26 | 58.75,44.62 v59.12,44.25 | v59.5,3.75 59.38,3.62 46.88,3.62 45.88,4.62 JP1.25 | v34.75,48.5 60.62,48.5 61.38,47.75 61.38,44.62 58.75,44.62
  Bottom 0.152: v33,29.12 v33,46.75 v34.75,48.5 | v59.12,44.25 59.12,44 60.25,42.88 v60.25,31.62 60.38,31.5 60.38,13.88 60.75,13.5 60.75,9.5 59.38,8.12 59.38,7.12 59.62,6.88 59.62,3.88 v59.5,3.75
A11  (via drill 0.35)
  Top 0.152: v35.88,46.62 35.12,47.38 32.75,47.38 32.25,46.88 32.25,45.5 AS7C34096A-10TCN-3.27 | AS7C34096A-10TCN-1.27 32.25,30.38 32.25,32 v35.25,32 37.5,29.75 v42.62,29.75 | v61,32.25 57.62,32.25 57.62,30.38 AS7C34096A-10TCN-2.27 | v60.62,43.38 60.38,43.62 58.88,43.62 57.62,44.88 57.62,45.38 AS7C34096A-10TCN-4.27 | v61,21 59.38,21 59.12,21.25 44.88,21.25 v44.62,21 v42.62,21
  Bottom 0.152: v35.25,32 35.88,32.62 v35.88,46.62 | v60.62,43.38 60.62,32.62 v61,32.25 v61,21 | v44.62,21 44.38,20.75 44.38,9.62 44.62,9.38 44.62,6 43.38,4.75 JP1.27 | v42.62,29.75 42.88,29.5 42.88,21.25 v42.62,21
A12  (via drill 0.35)
  Top 0.152: v55,31.62 56.62,31.62 56.62,30.38 AS7C34096A-10TCN-2.28 | AS7C34096A-10TCN-4.28 56.62,45.38 56.62,45 v55.88,44.25 34.75,44.25 | v35.25,33 34.62,32.38 31.38,32.38 31.38,30.38 AS7C34096A-10TCN-1.28 | 34.38,44.62 34.75,44.25 | 34.38,44.62 31.75,44.62 31.38,45 31.38,45.38 AS7C34096A-10TCN-3.28 | v38.88,8.25 39.5,8.88 43.38,8.88 44.5,10 44.5,13.38 v45,13.38 | v43,45.25 42.75,45 37.25,45 36.75,45.5 36.25,45.5 35.88,45.12 35.88,44.62 34.38,44.62 | 34.75,44.25 v35,44
  Bottom 0.152: v55,31.62 54.38,32.25 54.38,42.75 v55.88,44.25 | v35.25,33 35,33.25 v35,44 | v38.88,8.25 38.88,5.38 38.25,4.75 JP1.31 | v45,13.38 45.12,13.5 45.12,20.62 45.25,20.75 45.25,28.25 44.25,29.25 44.25,44 v43,45.25
A13  (via drill 0.35)
  Top 0.152: 58.38,46.38 56.38,46.38 56,46 56,45.5 AS7C34096A-10TCN-4.29 | 58.38,46.38 61,46.38 61,47.62 60.5,48.12 42,48.12 41.75,47.88 30.62,47.88 30.62,45.5 AS7C34096A-10TCN-3.29 | 46.38,27.5 46.62,27.25 53,27.25 54.12,28.38 55.25,28.38 55.88,29 55.88,29.38 | 46.38,27.5 45.38,28.5 30.62,28.5 30.62,30.25 AS7C34096A-10TCN-1.29 | 55.88,29.38 55.88,30.25 AS7C34096A-10TCN-2.29 | v32.38,8.25 31.75,8.88 v31.12,8.88 | v31.38,14.25 31.62,14 44.88,14 v45.75,14.88 | 46.38,27.5 v46.25,27.38 | v58.38,46.75 58.38,46.38 | v61.25,36.38 61.88,35.75 61.88,29.38 55.88,29.38
  Bottom 0.152: v32.38,8.25 32.38,8 35.62,4.75 JP1.33 | v31.12,8.88 31.38,9.12 v31.38,14.25 | v45.75,14.88 46.25,15.38 v46.25,27.38 | v58.38,46.75 61.25,43.88 v61.25,36.38
A14  (via drill 0.35)
  Top 0.152: v29.75,28.75 AS7C34096A-10TCN-1.30 29.62,30.38 29.62,32 29.12,32.5 v28.12,32.5 | 29.62,43.38 29.62,45.38 AS7C34096A-10TCN-3.30 | v28.12,43.38 29.62,43.38 | v55,29 55.12,29 55.12,30.25 AS7C34096A-10TCN-2.30 | v54,27.38 53.38,26.75 39.5,26.75 38.75,27.5 v29.75,27.5 | v36.5,44.88 36.75,44.62 55.12,44.62 55.12,45.38 AS7C34096A-10TCN-4.30 | v36.5,43.62 36.25,43.38 29.62,43.38
  Bottom 0.152: v29.75,28.75 v29.75,27.5 29.75,16.75 32,14.5 32,12.12 31.75,11.88 31.75,6.88 33.12,5.5 33.12,4.75 JP1.35 | v28.12,32.5 v28.12,43.38 | v55,29 54,28 v54,27.38 | v36.5,43.62 v36.5,44.88
A15  (via drill 0.35)
  Top 0.152: v50.12,31.5 50,31.38 48.75,31.38 48.75,30.38 AS7C34096A-10TCN-2.38 | v50.12,47.5 50,47.38 49.25,47.38 48.88,47 | 48.88,47 48.75,46.88 AS7C34096A-10TCN-4.38 | v23.88,28.38 23.38,28.38 23.38,30.25 AS7C34096A-10TCN-1.38 | 23.38,43.38 23.38,45.38 AS7C34096A-10TCN-3.38 | v24.75,43.38 23.38,43.38 | 48.88,47 48.25,47.62 42,47.62 v40,45.62 | v36.5,42.12 17.88,42.12 17.5,42.5 17.5,43.38 23.38,43.38
  Bottom 0.152: v50.12,31.5 49.88,31.75 49.88,46.25 50.12,46.5 v50.12,47.5 | JP1.37 30.5,4.75 30.5,5.25 24.38,11.38 24.38,27.88 v23.88,28.38 24.75,29.25 24.75,32.12 24.5,32.38 24.5,43.12 v24.75,43.38 | v36.5,42.12 v40,45.62
A16  (via drill 0.35)
  Top 0.152: v50.5,32.5 50.25,32.5 49.5,31.75 48,31.75 48,30.38 AS7C34096A-10TCN-2.39 | v48.12,46.75 48.12,45.5 48,45.5 AS7C34096A-10TCN-4.39 | v19.5,28.38 22.5,28.38 22.5,30.25 AS7C34096A-10TCN-1.39 | v22,44.25 22.5,44.75 22.5,45.38 AS7C34096A-10TCN-3.39 | v19.5,13.25 28,4.75 JP1.39 | v47.75,52.5 28.62,52.5 27.62,51.5 v24.88,51.5
  Bottom 0.152: v50.5,32.5 50.5,47 50.75,47.25 50.75,47.75 50.38,48.12 48.12,48.12 | v48.12,46.75 48.12,48.12 | v19.5,13.25 v19.5,28.38 19.5,35.62 22,38.12 v22,44.25 22,48.62 v24.88,51.5 | 48.12,48.12 47.75,48.5 v47.75,52.5
A17  (via drill 0.35)
  Top 0.152: v45.25,47 45.5,46.75 46.38,46.75 47.12,46 47.12,45.5 AS7C34096A-10TCN-4.40 | AS7C34096A-10TCN-2.40 47.12,30.25 47.12,29.12 v45.25,29.12 v34.38,29.12 | v18.88,29.12 21.62,29.12 21.62,30.25 AS7C34096A-10TCN-1.40 | v20.75,46.75 21.12,46.38 21.25,46.38 21.62,46 21.62,45.5 AS7C34096A-10TCN-3.40 | v26.12,2.62 27.62,1.12 29.5,1.12 30.5,2.12 JP1.38 | v18.88,26.12 v34.38,26.12
  Bottom 0.152: v45.25,47 v45.25,29.12 | v20.75,46.75 19.12,45.12 19.12,29.38 v18.88,29.12 v18.88,26.12 18.88,9.88 v26.12,2.62 | v34.38,26.12 v34.38,29.12
A18  (via drill 0.35)
  Top 0.152: v42.38,46 42.75,46.38 45.88,46.38 46.25,46 46.25,45.5 AS7C34096A-10TCN-4.41 | AS7C34096A-10TCN-2.41 46.25,30.38 46.25,31.75 v42.62,31.75 41.25,30.38 v40.62,30.38 | AS7C34096A-10TCN-1.41 20.88,30.38 v20.88,31.5 19.12,31.5 v18.5,32.12 | v18.5,44 20.88,44 20.88,45.38 AS7C34096A-10TCN-3.41 | v35.62,24.75 35.62,23.88 35.25,23.88 34.62,23.25 v20.75,23.25
  Bottom 0.152: v42.62,31.75 42.38,32 v42.38,46 | v20.88,31.5 20.75,31.38 v20.75,23.25 20.75,21.38 20.5,21.12 20.5,9.75 JP1.40 | v18.5,44 18.75,43.75 18.75,32.38 v18.5,32.12 | v40.62,30.38 35.62,25.38 v35.62,24.75
AUD_L  (via drill 0.35)
  Top 0.152: v41.88,56.12 42,56 59.88,56 69.75,46.12 72.25,46.12 77.25,41.12 78.25,41.12 v81.25,38.12
  Bottom 0.152: v41.88,56.12 36.12,61.88 36.12,64.62 35.75,65 JP2.7 | v81.25,38.12 87.88,31.5 87.88,26.75 87,25.88 85.25,25.88 85.25,15.62 80.38,10.75 R10.P$1
AUD_R  (via drill 0.35)
  Top 0.152: v32.25,66.62 32.12,66.5 29.12,66.5 28.12,67.5 JP2.2 | v40.62,43.62 40.75,43.5 58.25,43.5 59.12,42.62 64.5,42.62 v70.75,36.38
  Bottom 0.152: v32.25,66.62 32.62,66.62 33.12,66.12 34.12,66.12 34.12,65.5 34.25,65.38 34.25,64.25 34,64 34,60.38 40.62,53.75 v40.62,43.62 | v70.75,36.38 72.38,34.75 72.38,17.25 73.88,15.75 R11.P$1
AUDIO_OUT_L
  Top 0.152: AUDIOOUT.PL 90.75,7.62 89,9.38 86.62,9.38 C8.2
AUDIO_OUT_L1
  Top 0.152: C8.1 84,9.38 84,3.12 C5.2 83.88,3.12 80.38,3.12 R10.P$2
AUDIO_OUT_R
  Top 0.152: AUDIOOUT.PR 90.75,17.75 90.12,17.12 86.62,17.12 C7.2
AUDIO_OUT_R1
  Top 0.152: C7.1 84,17 82.75,15.75 81.62,15.75 R11.P$2
  Bottom 0.152: C6.1 81.75,20.75 84,18.5 84,17.12 C7.1
B0
  Bottom 0.152: JP2.36 71.25,67.5 72.62,66.12 72.62,47.5 70.12,45 R7.P$1
B1
  Bottom 0.152: JP2.37 73.75,65 73.25,64.5 73.25,45.62 70.12,42.5 R8.P$1
B2
  Bottom 0.152: R9.P$1 74.88,44.62 74.88,66.5 73.88,67.5 JP2.38
BT_RST  (via drill 0.35)
  Top 0.152: v40,50.88 40.5,50.38 42.62,50.38 RESET.3 | JP5.9 91.62,65 90.62,64 35.25,64 34.25,65 33.25,65 JP2.5
  Bottom 0.152: v40,50.88 33.62,57.25 33.62,64.62 33.25,65 JP2.5
D0  (via drill 0.35)
  Top 0.152: v25,20.75 25,19.12 AS7C34096A-10TCN-1.9 | v25.12,33 25.12,34.12 25,34.12 AS7C34096A-10TCN-3.9 | v75.5,38.75 70.5,43.75 69.25,43.75 59.38,53.62 47.38,53.62 46.88,54.12 43.75,54.12 43.25,53.62 v25.5,53.62 | v19.75,36.75 17.12,34.12 17.12,27.12 v25.25,27.12
  Bottom 0.152: v25,20.75 25.12,20.88 25.12,27.12 | v25.12,33 25.12,27.12 | v75.5,38.75 75.5,34.38 75.25,34.12 75.25,24.12 77.38,22 77.38,3.25 76.38,2.25 JP1.2 | v25.5,53.62 21.38,49.5 21.38,38.38 v19.75,36.75 | 25.12,27.12 v25.25,27.12
D1  (via drill 0.35)
  Top 0.152: v25.88,20.25 25.75,20.25 25.75,19.12 AS7C34096A-10TCN-1.10 | v26.5,32 26.5,32.38 25.75,33.12 25.75,34.12 AS7C34096A-10TCN-3.10 | v65.75,46.38 60.88,51.25 50,51.25 49.75,51.5 34.25,51.5 31.88,49.12 31.38,49.12 v29,46.75
  Bottom 0.152: v25.88,20.25 26.5,20.88 v26.5,32 26.5,33.12 26.75,33.38 26.75,44.5 v29,46.75 | v65.75,46.38 65.75,40.5 71.75,34.5 71.75,16.25 73.5,14.5 73.5,9.62 72.75,8.88 72.75,3.25 73.75,2.25 JP1.4
D2  (via drill 0.35)
  Top 0.152: v28.25,20.75 28.25,19.12 AS7C34096A-10TCN-1.13 28.12,19 28.12,17.12 28.5,16.75 49.75,16.75 v50.5,16 | v27.25,33 27.62,33.38 27.75,33.38 28.12,33.75 28.12,34.12 AS7C34096A-10TCN-3.13 | v50.38,6 67.62,6 67.62,1.75 68.25,1.12 70.25,1.12 71.25,2.12 JP1.6
  Bottom 0.152: v28.25,20.75 28.75,21.25 28.75,27.12 27.25,28.62 v27.25,33 | v50.38,6 50.5,6.12 v50.5,16
D3  (via drill 0.35)
  Top 0.152: v28.75,17.38 28.88,17.38 28.88,19 AS7C34096A-10TCN-1.14 | v28.75,16.12 29,16.38 35,16.38 | 35,16.38 49.12,16.38 v49.5,16 | v49.88,7 50.25,6.62 50.62,6.62 50.88,6.38 68.5,6.38 69.75,5.12 69.75,2.25 68.75,2.25 JP1.8 | v29.75,35.38 29,35.38 29,34.25 AS7C34096A-10TCN-3.14 | v33.62,38.25 v31.75,38.25 | 35,16.38 v35,16.12
  Bottom 0.152: v28.75,16.12 v28.75,17.38 | v49.5,16 50,15.5 50,7.12 v49.88,7 | v29.75,35.38 31.75,37.38 v31.75,38.25 | v33.62,38.25 34.62,37.25 34.62,29.75 35,29.38 v35,16.12
D4  (via drill 0.35)
  Top 0.152: v28.88,31.88 28.88,30.38 AS7C34096A-10TCN-1.31 | v28.75,44.25 28.75,45.38 28.88,45.38 AS7C34096A-10TCN-3.31 | v64.62,7 64.38,6.75 51,6.75 50.12,7.62 v30.75,7.62
  Bottom 0.152: v28.75,44.25 28.75,32 v28.88,31.88 28.88,27.5 29.38,27 29.38,15.88 29.25,15.75 29.25,9.12 v30.75,7.62 | v64.62,7 64.62,3.75 66.12,2.25 JP1.10
D5  (via drill 0.35)
  Top 0.152: v42.25,27.88 42,28.12 28.25,28.12 28.25,30.25 AS7C34096A-10TCN-1.32 | v41.12,42.75 27.88,42.75 27.5,43.12 27.5,44.62 27.75,44.62 28.12,45 28.12,45.38 AS7C34096A-10TCN-3.32 | v60,7.38 59.75,7.12 51.12,7.12 50.25,8 42.62,8 v42.38,8.25
  Bottom 0.152: v41.12,42.75 42,41.88 42,28.12 v42.25,27.88 41.88,27.5 41.88,8.75 v42.38,8.25 | v60,7.38 60,4.38 60.12,4.25 60.12,3.12 61,2.25 JP1.14
D6  (via drill 0.35)
  Top 0.152: v18.25,27.75 25.62,27.75 25.62,30.25 AS7C34096A-10TCN-1.35 | v18.12,42.75 25,42.75 25.62,43.38 25.62,45.38 AS7C34096A-10TCN-3.35 | v44.38,3.12 43.88,3.62 42.12,3.62 42,3.75 41.25,3.75 41.12,3.62 27.38,3.62 v18.25,12.75
  Bottom 0.152: v18.12,42.75 18.38,42.5 18.38,33.5 17.88,33 17.88,28.12 v18.25,27.75 v18.25,12.75 | v44.38,3.12 44.38,1.12 56.38,1.12 57.12,1.88 57.12,2.12 58.5,2.12 JP1.16
D7  (via drill 0.35)
  Top 0.152: v17.75,33.75 19.12,32.38 23.38,32.38 23.5,32.5 24.38,32.5 24.5,32.38 24.88,32.38 24.88,30.38 AS7C34096A-10TCN-1.36 | v17.5,45.75 19.12,47.38 23.5,47.38 24.88,46 24.88,45.5 AS7C34096A-10TCN-3.36 | v41.75,3.12 41.88,3.12 41.88,2.12 42.88,1.12 55,1.12 56,2.12 JP1.18 | v41.88,5.62 41.75,5.75 28.5,5.75 v16,18.25
  Bottom 0.152: v17.75,33.75 17.75,42.25 17.5,42.5 v17.5,45.75 17.5,47 16,47 15.38,46.38 15.38,18.88 v16,18.25 | v41.75,3.12 41.88,3.25 v41.88,5.62
D8  (via drill 0.35)
  Top 0.152: v47.88,20.25 50.25,20.25 50.25,19.12 AS7C34096A-10TCN-2.9 | v47.62,32.25 47.75,32.38 48.88,32.38 50.25,33.75 50.25,34.12 AS7C34096A-10TCN-4.9 | v54.5,7.75 53.38,8.88 v49.38,8.88
  Bottom 0.152: v47.62,32.25 47.62,20.5 v47.88,20.25 47.12,19.5 47.12,14.75 49.12,12.75 49.12,9.12 v49.38,8.88 | v54.5,7.75 54.5,3.25 53.5,2.25 JP1.20
D9  (via drill 0.35)
  Top 0.152: v51.25,17 51.25,19 AS7C34096A-10TCN-2.10 | v51.38,33 51.25,33 51.25,34.12 AS7C34096A-10TCN-4.10
  Bottom 0.152: JP1.22 52,3.25 52,4.75 53.12,5.88 53.12,15.12 v51.25,17 51,17.25 51,31.75 51.12,31.88 51.12,32.75 v51.38,33
D10  (via drill 0.35)
  Top 0.152: v53.5,20.25 53.5,19.12 AS7C34096A-10TCN-2.13 | v53.38,33 53.38,34.12 53.5,34.12 AS7C34096A-10TCN-4.13 | v44,8.62 v47.38,8.62 | v53.38,22.62 v44.62,22.62
  Bottom 0.152: v53.5,20.25 53.38,20.38 v53.38,22.62 v53.38,33 | v47.38,8.62 47.38,3.25 48.38,2.25 JP1.24 | v44,8.62 44,22 v44.62,22.62
D11  (via drill 0.35)
  Top 0.152: v54.38,17 54.38,19 AS7C34096A-10TCN-2.14 | v47.75,13.25 54.25,13.25 v54.38,13.38 61.62,13.38 v61.75,13.25 | v61.25,35.38 54.38,35.38 54.38,34.25 AS7C34096A-10TCN-4.14
  Bottom 0.152: v54.38,13.38 v54.38,17 | v47.75,13.25 46.75,12.25 46.75,5.25 46.88,5.12 46.88,3.25 45.88,2.25 JP1.26 | v61.25,35.38 61.75,34.88 v61.75,13.25
D12  (via drill 0.35)
  Top 0.152: v54,31.75 54.25,31.75 54.25,30.38 AS7C34096A-10TCN-2.31 | v54.75,46.75 54.75,46.38 54.38,46 54.38,45.5 AS7C34096A-10TCN-4.31 | v67,3.62 61.12,3.62 60.62,3.12 59.25,3.12 59.12,3.25 45.5,3.25 44.75,2.5 43.62,2.5 43.38,2.25 JP1.28
  Bottom 0.152: v54,31.75 54,46 v54.75,46.75 52.62,48.88 52.62,49.75 56.25,49.75 62.5,43.5 62.5,29.12 65.12,26.5 65.12,22.75 64.12,21.75 64.12,15.38 65.38,15.38 65.5,15.5 66.12,15.5 66.5,15.12 66.5,14.62 66.25,14.38 66.25,9.5 67.25,8.5 67.25,3.88 v67,3.62
D13  (via drill 0.35)
  Top 0.152: v50.38,27.88 52.75,27.88 53.12,28.25 53.5,28.25 53.5,30.25 AS7C34096A-10TCN-2.32 | v49.5,25 47.75,23.25 v40.88,23.25 | v39.62,13 39.12,12.5 v37,12.5 | v53.75,46.75 53.62,46.75 53.62,45.5 AS7C34096A-10TCN-4.32 | v53.12,42.88 51.88,41.62 v41.38,41.62
  Bottom 0.152: v50.38,27.88 49.5,27 v49.5,25 | v39.62,13 41.12,14.5 41.12,23 v40.88,23.25 40.62,23.5 40.62,26.75 41.62,27.75 41.62,41.38 v41.38,41.62 | v37,12.5 36.88,12.38 36.88,3.5 38.12,2.25 JP1.32 | v53.75,46.75 53.12,46.12 v53.12,42.88
D14  (via drill 0.35)
  Top 0.152: v51.62,31.5 51.25,31.5 51.25,30.38 AS7C34096A-10TCN-2.35 | v51.12,46.75 51.12,45.5 AS7C34096A-10TCN-4.35 | v16,19.25 v21.12,14.12 | v16.25,46.38 19,49.12 28.38,49.12 31.38,52.12 47.25,52.12 47.5,51.88 v50.25,51.88
  Bottom 0.152: v51.62,31.5 52,31.88 52,45.88 v51.12,46.75 51.12,51 v50.25,51.88 | v21.12,14.12 29.12,6.12 29.12,3.62 34.25,3.62 35.62,2.25 JP1.34 | v16,19.25 16.25,19.5 v16.25,46.38
D15  (via drill 0.35)
  Top 0.152: v46.25,28.5 50.25,28.5 50.25,30.25 AS7C34096A-10TCN-2.36 | v51.75,47.5 51.62,47.38 50.88,47.38 50.38,46.88 50.38,45.5 AS7C34096A-10TCN-4.36 | v24.62,3.25 32.12,3.25 33.12,2.25 JP1.36 | v17.12,35 19.88,37.75 27.38,37.75 27.5,37.62 36.75,37.62 v36.88,37.75 | v40.62,34 42.25,32.38 v45.88,32.38
  Bottom 0.152: v46.25,28.5 45.88,28.88 v45.88,32.38 45.88,52.25 46.38,52.75 46.38,53.38 46.75,53.75 48.62,53.75 49.88,52.5 51.75,52.5 v51.75,47.5 | v24.62,3.25 16.62,11.25 16.62,34.5 v17.12,35 | v40.62,34 v36.88,37.75
EAR_PORT  (via drill 0.35)
  Top 0.152: v67,24.5 68.5,26 75.25,26 76.38,27.12 R17.P$2 | v29.25,59.25 29.5,59 41.5,59 42.38,59.88 47.5,59.88 48.38,60.75 56.38,60.75 v65.12,52
  Bottom 0.152: Q1.C 65.12,17.12 67,19 v67,24.5 67,25.12 64.75,27.38 64.75,35.25 65.12,35.62 v65.12,52 | v29.25,59.25 29.12,59.38 29.12,64 28.12,65 JP2.1
G0
  Bottom 0.152: JP2.33 68.75,65 68.88,64.88 68.88,53.75 70,52.62 R4.P$1
G1
  Bottom 0.152: JP2.34 68.75,67.5 70.25,67.5 70.25,67.12 71.25,66.12 72.12,66.12 72.12,65.62 72.25,65.5 72.25,47.88 70.62,46.25 68.88,46.25 68.88,48.88 70,50 R5.P$1
G2
  Bottom 0.152: JP2.35 71.25,65 71.38,64.88 71.38,48.75 R6.P$1
GND  (via drill 0.35)
  Top 0.152: 26.62,26.5 26.62,30.25 AS7C34096A-10TCN-1.34 | 26.62,26.5 33.88,26.5 34.12,26.75 34.75,26.75 36,25.5 | 36,25.5 38.25,23.25 C1.1 | v27.38,22.25 27.38,19.12 AS7C34096A-10TCN-1.12 | v28.12,24.5 29.12,25.5 36,25.5 | 16.5,26.12 18,26.12 18.62,26.75 24.75,26.75 25,26.5 26.62,26.5 | 16.5,26.12 7.88,26.12 7.88,21 10.38,18.5 X3.8 | X2.8 10.5,54 10.75,54.25 19.38,54.25 19.88,54.75 NMI.1 20,54.88 21.12,56 32.5,56 | v26.62,46.75 26.62,45.5 AS7C34096A-10TCN-3.34 | v26.12,35.38 27.25,35.38 27.25,34.25 AS7C34096A-10TCN-3.12 | 32.5,56 38.38,56 38.88,55.5 42,55.5 42.62,54.88 RESET.1 | 32.5,56 31.38,54.88 DRIVE.1 | v51.75,29.12 51.88,29.12 51.88,30.25 AS7C34096A-10TCN-2.34 | v52.62,32.38 52.62,34.12 AS7C34096A-10TCN-4.12 | v52.5,20.25 52.62,20.25 52.62,19.12 AS7C34096A-10TCN-2.12 | v52.38,46.75 52,46.75 52,45.5 AS7C34096A-10TCN-4.34 | C5.1 86.88,3.12 90.38,6.62 92,6.62 95.88,10.5 95.88,12.62 AUDIOOUT.PCOM 96,12.75 96,25 EAR/MIC.PCOM 95.88,25.12 95,26 77.75,26 | 87.75,43.25 88.75,43.25 X1.10 | 87.75,43.25 87.38,43.25 86.38,42.25 X1.5 86.25,42.12 80.25,36.12 78.38,36.12 75.5,33.25 | X1.6 88.88,52.38 88.88,50.25 X1.7 88.88,50.12 88.88,48 X1.8 88.75,47.88 87.75,47.88 87.75,43.25 | 75.5,33.25 77.75,31 77.75,27.25 79,27.25 R14.P$1 79,27.12 78.88,27.12 77.75,26 | 75.5,33.25 74,34.75 D1.A 73.88,34.88 73,35.75 66.5,35.75 63.88,38.38 C4.1 63.75,38.5 v52.62,38.5 38.38,38.5 C3.1 38.25,38.5 37.88,38.88 v26.12,38.88 16.5,38.88 16.5,26.12 | 77.75,26 76.5,24.75 R13.P$2 | C2.1 63.88,23.12 64,23.12 70,17.12 Q1.E 70.12,17.12 75.25,17.12 78.88,20.75 C6.2
  Bottom 0.152: v27.38,22.25 28.12,23 v28.12,24.5 | JP1.30 40.75,2.25 39.5,3.5 39.5,9.38 39,9.88 39,14.38 38.25,15.12 38.25,16.88 38.5,17.12 38.5,23 38.38,23.12 C1.1 | DRIVE.1 31.38,54.75 32.5,53.62 32.5,49.12 29,49.12 v26.62,46.75 26.38,46.5 26.38,38.88 | v26.12,35.38 26.38,35.62 26.38,38.88 | v52.5,20.25 51.75,21 v51.75,29.12 52.62,30 v52.62,32.38 52.5,32.5 52.5,38.5 | v52.38,46.75 52.5,46.62 52.5,38.5 | v52.62,38.5 52.5,38.5 | JP5.5 86.62,65 86,64.38 86,55.88 88.75,53.12 88.75,52.5 X1.6 | C6.2 78.88,20.88 77.75,22 77.75,23.38 76.5,24.62 R13.P$2 | JP1.12 63.62,2.25 62.62,3.25 62.62,8.88 63.75,10 63.75,23.12 C2.1 | v26.12,38.88 26.38,38.88
HS
  Bottom 0.152: X1.13 91.38,46.75 92.38,45.75 92.38,41.88 91.38,40.88 79,40.88 79,61.88 76.38,64.5 76.38,65 JP2.39
JOY1_P1  (via drill 0.35)
  Top 0.152: v42.62,56.75 13,56.75 11.88,55.62 9.38,55.62 9.38,48 10,47.38 12.62,47.38 12.88,47.12 X2.1
  Bottom 0.152: v42.62,56.75 43.25,57.38 43.25,65 JP2.13
JOY1_P2  (via drill 0.35)
  Top 0.152: v44,53.5 43.75,53.25 28.38,53.25 28.12,53 16.12,53 13,49.88 X2.2
  Bottom 0.152: v44,53.5 45.5,55 45.5,64.75 45.75,65 JP2.15
JOY1_P3  (via drill 0.35)
  Top 0.152: v15.12,57.38 15.38,57.12 42.12,57.12 42.62,57.62 v46.12,57.62
  Bottom 0.152: v15.12,57.38 14,56.25 14,53.62 13,52.62 X2.3 | v46.12,57.62 48.38,59.88 48.38,65 JP2.17
JOY1_P4  (via drill 0.35)
  Top 0.152: v14.12,57.38 14.75,58 20,58 20.5,57.5 42,57.5 42.75,58.25 v48.25,58.25
  Bottom 0.152: v14.12,57.38 13.62,56.88 13.62,56 13,55.38 X2.4 | v48.25,58.25 50.88,60.88 50.88,65 JP2.19
JOY1_P6  (via drill 0.35)
  Top 0.152: v25.5,52.25 20.12,52.25 16.62,48.75 10.75,48.75 10.5,48.5 X2.6 | v28.12,58.12 28.38,57.88 41.88,57.88 42.75,58.75 47.88,58.75 48,58.88 v50.62,58.88
  Bottom 0.152: v25.5,52.25 28.12,54.88 v28.12,58.12 | v50.62,58.88 53.38,61.62 53.38,65 JP2.21
JOY1_P7  (via drill 0.35)
  Top 0.152: v11.5,59.75 11.75,59.5 15.88,59.5 16.25,59.12 28.5,59.12 29,58.62 41.62,58.62 42.5,59.5 47.62,59.5 48.25,60.12 v56.12,60.12
  Bottom 0.152: v11.5,59.75 11.5,52.25 10.5,51.25 X2.7 | v56.12,60.12 61,65 JP2.27
JOY1_P9  (via drill 0.35)
  Top 0.152: v53,59.5 48.12,59.5 47.75,59.12 42.62,59.12 41.75,58.25 28.88,58.25 28.38,58.75 16.12,58.75 15.75,59.12 10.5,59.12 10.5,56.75 X2.9
  Bottom 0.152: v53,59.5 58.5,65 JP2.25
JOY2_P1  (via drill 0.35)
  Top 0.152: v20.75,61.12 20.88,61 32.5,61 32.75,60.75 v38.5,60.75
  Bottom 0.152: v20.75,61.12 14.75,55.12 14.75,13.38 13,11.62 X3.1 | v38.5,60.75 42.25,64.5 42.25,66.5 43.25,67.5 JP2.14
JOY2_P2  (via drill 0.35)
  Top 0.152: v43.88,61.25 42.25,61.25 41.12,60.12 38.25,60.12 38,60.38 32.62,60.38 32.38,60.62 27.62,60.62 27.5,60.5 18.88,60.5 18,61.38 6.88,61.38 6.88,20.5 10,17.38 10.12,17.38 11.5,16 12.88,16 12.88,14.38 X3.2
  Bottom 0.152: v43.88,61.25 44.75,62.12 44.75,66.5 45.75,67.5 JP2.16
JOY2_P3  (via drill 0.35)
  Top 0.152: v7.5,59.62 8.88,61 17.88,61 18.75,60.12 28.75,60.12 28.88,60.25 32.25,60.25 32.5,60 37.88,60 38.12,59.75 41.25,59.75 42.12,60.62 45.25,60.62 v46.12,61.5
  Bottom 0.152: v7.5,59.62 7.5,17.12 12.88,17.12 X3.3 | v46.12,61.5 47.38,62.75 47.38,66.5 48.38,67.5 JP2.18
JOY2_P4  (via drill 0.35)
  Top 0.152: v10,59.75 10.62,60.38 18,60.38 18.62,59.75 28.88,59.75 29,59.88 32.12,59.88 32.62,59.38 41.38,59.38 42.25,60.25 47.38,60.25 48.62,61.5 v49,61.5
  Bottom 0.152: v10,59.75 7.88,57.62 7.88,19.88 12.88,19.88 X3.4 | v49,61.5 49.88,62.38 49.88,66.5 50.88,67.5 JP2.20
JOY2_P6  (via drill 0.35)
  Top 0.152: v14.12,26.75 14.12,28.12 16.12,30.12 16.12,40.75 v29.75,40.75 | v41.25,49.75 v40,49.75
  Bottom 0.152: v14.12,26.75 14.12,14 13.88,13.75 13.88,13 10.5,13 X3.6 | v29.75,40.75 32.38,43.38 32.38,47 34.5,49.12 40,49.12 v40,49.75 | v41.25,49.75 41.5,50 41.5,50.75 43.62,52.88 46,52.88 46,55.12 52.38,61.5 52.38,66.5 53.38,67.5 JP2.22
JOY2_P7  (via drill 0.35)
  Top 0.152: v34.62,63.75 32.62,63.75 31.12,62.25 6.5,62.25 6.5,19.62 10.38,15.75 X3.7 | v34.75,66 34.88,66.12 54.62,66.12 v54.75,66
  Bottom 0.152: v34.62,63.75 34.62,65.88 v34.75,66 | v54.75,66 56,67.25 56,67.5 JP2.24
JOY2_P9  (via drill 0.35)
  Top 0.152: v19.75,61.12 20.5,61.88 32.38,61.88 32.62,62.12 v36.75,62.12 | v37.75,61.38 38,61.62 43.38,61.62 43.88,62.12 54.12,62.12 v54.38,61.88
  Bottom 0.152: v19.75,61.12 14.38,55.75 14.38,47 8.88,41.5 8.88,28.75 9.12,28.5 9.12,22.38 10.38,21.12 X3.9 | v36.75,62.12 37.75,62.12 v37.75,61.38 | v54.38,61.88 57.5,65 57.5,66.5 58.5,67.5 JP2.26
MIC_PORT  (via drill 0.35)
  Top 0.152: v33,61.5 37,61.5 37.5,62 43.25,62 43.75,62.5 55.88,62.5 69.62,48.75 70.62,48.75 v76.25,43.12
  Bottom 0.152: v33,61.5 31.25,63.25 31.25,64.38 30.62,65 JP2.3 | v76.25,43.12 76.5,42.88 76.5,39 80.25,35.25 80.25,25.88 79.12,24.75 R12.P$1
N$5
  Top 0.152: R12.P$2 85.38,23.38 70.12,23.38 68.88,24.62 R13.P$1
  Bottom 0.152: EAR/MIC.PL 90.75,20.12 86.75,24.12 86.75,24.62 R12.P$2
N$7
  Bottom 0.152: R15.P$2 86.62,29.75 81.75,34.62 81.75,34.75 C9.2
N$8
  Top 0.152: EAR/MIC.PR 90.75,30.12 87.88,27.25 86.75,27.25 R14.P$2 86.62,27.25 81.5,27.25 79.12,29.62 R15.P$1
N$9
  Top 0.152: D1.C 66.38,34.75 71.38,29.75 76.38,29.75 R16.P$1
  Bottom 0.152: C9.1 78.88,34.75 76.5,32.38 76.5,29.75 R16.P$1
N$10
  Bottom 0.152: Q1.B 67.62,17.12 67.62,28.5 68.75,29.62 R16.P$2
NMI_DIVMMC
  Top 0.152: JP5.10 91.62,67.62 90.62,68.62 31.62,68.62 30.62,67.62 JP2.4
  Bottom 0.152: JP2.4 30.5,67.5 29.5,66.5 29.5,59.88 30.12,59.25 30.12,51.5 31.25,50.38 DRIVE.3
NMI_MULTIFACE  (via drill 0.35)
  Top 0.152: v80.88,63 80.25,62.38 63.25,62.38 62.38,63.25 39,63.25 38.5,62.75 v33,62.75
  Bottom 0.152: 31.62,67.62 33.12,67.62 JP2.6 | 31.62,67.62 31.62,68 31,68.62 21.38,68.62 21.38,51.75 20,50.38 NMI.3 | v80.88,63 80.88,64.38 81.5,65 JP5.1 | v33,62.75 31.62,64.12 31.62,67.62
R0  (via drill 0.35)
  Top 0.152: v62.62,61.62 64,60.25 70,60.25 R1.P$1
  Bottom 0.152: v62.62,61.62 62.62,66 61.12,67.5 JP2.28
R1  (via drill 0.35)
  Top 0.152: v68.25,59.5 70,57.75 R2.P$1
  Bottom 0.152: v68.25,59.5 68.25,63 66.25,65 JP2.31
R2  (via drill 0.35)
  Top 0.152: v65.12,59.62 69.62,55.12 70,55.12 R3.P$1
  Bottom 0.152: v65.12,59.62 65.12,66.5 66.12,67.5 JP2.32
RAM_CE1  (via drill 0.35)
  Top 0.152: v25.12,17.75 24.25,17.75 24.25,19 AS7C34096A-10TCN-1.8 | v28.62,14.25 29.25,13.62 39.88,13.62 40.38,13.12 40.38,10.75 JP3.5
  Bottom 0.152: v28.62,14.25 v25.12,17.75
RAM_CE2  (via drill 0.35)
  Top 0.152: v37.88,17.38 38.12,17.12 49.5,17.12 49.5,19 AS7C34096A-10TCN-2.8
  Bottom 0.152: v37.88,17.38 37.88,10.75 JP3.4
RAM_CE3  (via drill 0.35)
  Top 0.152: v25.12,35.38 24.25,35.38 24.25,34.25 AS7C34096A-10TCN-3.8 | v25.88,25.5 27.5,23.88 v34.38,23.88
  Bottom 0.152: v25.12,35.38 25.88,34.62 v25.88,25.5 | v34.38,23.88 34.38,11.62 35.25,10.75 JP3.3
RAM_CE4  (via drill 0.35)
  Top 0.152: v47.75,37 49.5,37 49.5,34.25 AS7C34096A-10TCN-4.8 | v47.5,35.38 47.38,35.5 41.5,35.5 v41,35 | v40.25,14.62 40,14.38 32.12,14.38 31.62,14.88 28.38,14.88 28,14.5 28,12.5 31,12.5 32.75,10.75 JP3.2
  Bottom 0.152: v47.75,37 47.5,36.75 v47.5,35.38 | v41,35 41.25,34.75 41.25,27.88 40.25,26.88 40.25,23 40.75,22.5 40.75,15.12 v40.25,14.62
RAM_OE  (via drill 0.35)
  Top 0.152: v49.5,29.12 49.5,30.25 AS7C34096A-10TCN-2.37 | v49.5,46.75 49.5,45.5 AS7C34096A-10TCN-4.37 | v24.12,31.88 24.12,30.38 AS7C34096A-10TCN-1.37 | v24.12,44.25 24.12,45.38 AS7C34096A-10TCN-3.37 | v23.75,14.88 26.5,12.12 28.88,12.12 30.25,10.75 JP3.1 | v47,53.12 46.75,52.88 28.5,52.88 27.75,52.12 v26.5,52.12
  Bottom 0.152: v49.5,46.75 49.5,46.12 | 49.5,46.12 v49.5,29.12 | v23.75,14.88 23.75,27.62 23.25,28.12 23.25,31 v24.12,31.88 v24.12,44.25 24.12,49.75 v26.5,52.12 | 49.5,46.12 47,46.12 v47,53.12
RAM_WE  (via drill 0.35)
  Top 0.152: 54.5,20.12 55.12,19.5 55.12,19.12 AS7C34096A-10TCN-2.15 | 54.5,20.12 53.75,20.88 46.62,20.88 46.12,20.38 40,20.38 36.75,17.12 29.75,17.12 AS7C34096A-10TCN-1.15 29.75,19.12 29.75,19.62 v30.38,20.25 | v29.75,32.75 29.75,34.12 AS7C34096A-10TCN-3.15 | v55,32.62 55.12,32.62 55.12,34.12 AS7C34096A-10TCN-4.15 | 54.5,20.12 v55,20.62
  Bottom 0.152: v29.75,32.75 30.38,32.12 v30.38,20.25 | v55,32.62 55.62,32 55.62,21.25 v55,20.62 55,20.38 55.62,19.75 55.62,8 55,7.38 55,3.62 58.62,3.62 59.62,2.62 59.62,1.12 74.25,1.12 74.88,1.75 74.88,3.25 76.25,4.62 JP1.1
SD_CS  (via drill 0.35)
  Top 0.152: v38.25,63.38 38.5,63.62 62.5,63.62 63.38,62.75 63.88,62.75 64.12,63 v79.25,63
  Bottom 0.152: v38.25,63.38 38.25,65 JP2.9 | v79.25,63 80.5,64.25 80.5,66.5 81.5,67.5 JP5.2
SD_CS2  (via drill 0.35)
  Top 0.152: v39.5,62.62 39.75,62.88 62.25,62.88 63.12,62 88,62 89.62,63.62 91.75,63.62 92.75,64.62 92.75,66.12 90.25,66.12 89.25,65.12 JP5.7
  Bottom 0.152: v39.5,62.62 39.5,66.12 36.75,66.12 36.25,66.62 36.25,67 35.75,67.5 JP2.8
SD_MISO
  Top 0.152: JP2.10 38.25,67.5 39.25,66.5 54.38,66.5 54.5,66.62 55.5,66.62 55.62,66.5 88.12,66.5 89.12,67.5 JP5.8
SD_MOSI
  Top 0.152: JP2.23 56.12,65.12 57.12,66.12 83,66.12 84,65.12 JP5.3
SD_SCK  (via drill 0.35)
  Top 0.152: v20.75,62.88 24,66.12 31.88,66.12 32,66 32.62,66 33.12,66.5 34.38,66.5 34.5,66.62 35.12,66.62 35.25,66.5 36.5,66.5 v36.88,66.88
  Bottom 0.152: v20.75,62.88 20.75,62.25 8.12,62.25 6.88,61 6.88,15 14.5,7.38 14.5,1.12 41.12,1.12 41.88,1.88 41.88,2.25 42.38,2.75 42.38,3.38 42.25,3.5 42.25,5.12 43,5.88 43,10.62 JP3.6 | v36.88,66.88 37.12,67.12 37.12,67.88 37.88,68.62 86.62,68.62 86.62,67.62 JP5.6
VGA_BLUE
  Top 0.152: X1.3 84.5,45 77.75,45 R7.P$2 77.75,44.88 77.75,42.5 R8.P$2
  Bottom 0.152: R9.P$2 77.75,42.38 R8.P$2
VGA_GREEN
  Top 0.152: 77.75,50 85.38,50 86.25,49.12 X1.2 | 77.75,50 R6.P$2 | 77.75,50 R5.P$2 77.75,50.12 77.75,52.5 R4.P$2
VGA_RED
  Top 0.152: R1.P$2 77.75,60.12 77.75,57.75 R2.P$2 77.75,57.62 77.75,55.12 R3.P$2 77.75,55 82.62,55 86.25,51.38 X1.1
VS
  Bottom 0.152: X1.14 91.25,44.5 87.25,44.5 87.25,54.12 77.38,64 77.38,66.5 76.38,67.5 JP2.40

### Text on the board
Reference: 0.1uf | 0.1uf | 0.1uf | 0.1uf | 0.1uf | 10nf | 10nf
tDocu: Spectrum Next / breakout board / for MiSTer v1.0 | Ear/Mic | Audio Out